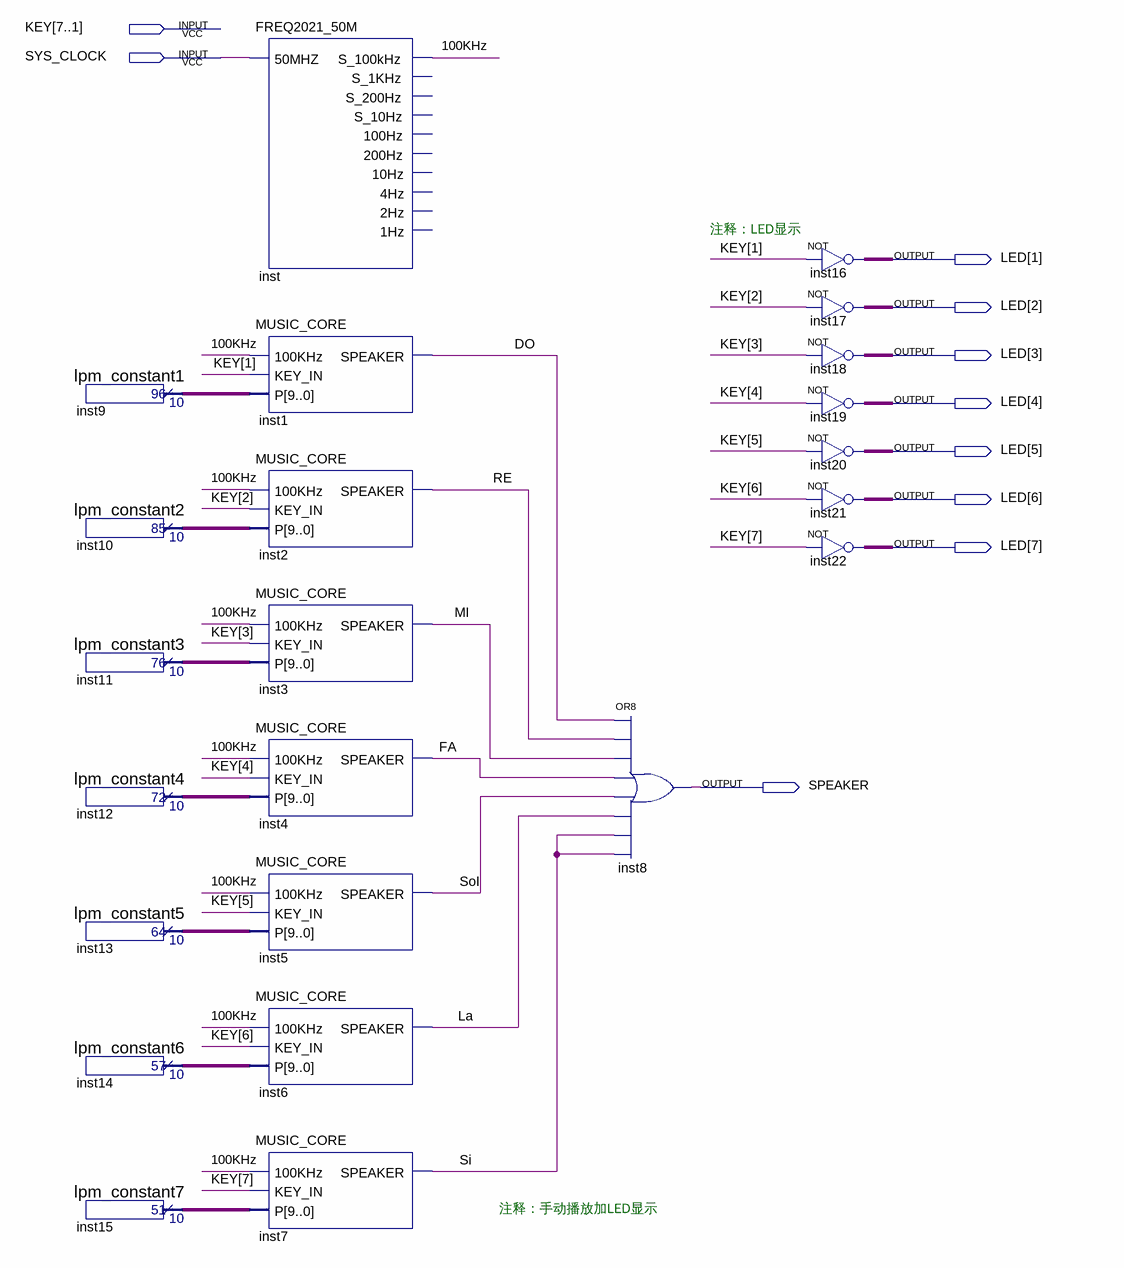
[diagram p0: schematic sheet]
// Quartus schematic PLAY.bdf as structural Verilog: 23 symbols, 10 pins
module PLAY (
  input  [7:1] KEY,
  input  SYS_CLOCK,
  output [7:1] LED,
  output SPEAKER
);

  wire \100KHz , DO, FA, La, MI, RE, Si, SoI;
  wire [9:0] inst9_result, inst10_result, inst11_result, inst12_result, inst13_result, inst14_result,
       inst15_result;

  lpm_constant1 inst9 (.result(inst9_result));
  lpm_constant2 inst10 (.result(inst10_result));
  lpm_constant3 inst11 (.result(inst11_result));
  lpm_constant4 inst12 (.result(inst12_result));
  lpm_constant5 inst13 (.result(inst13_result));
  lpm_constant6 inst14 (.result(inst14_result));
  lpm_constant7 inst15 (.result(inst15_result));
  FREQ2021_50M inst (
    .\50MHZ (SYS_CLOCK), .S_100kHz(\100KHz ));  // open: S_1KHz, S_200Hz, S_10Hz, 100Hz, 200Hz, 10Hz, 4Hz, 2Hz, 1Hz
  MUSIC_CORE inst1 (.\100KHz (\100KHz ), .KEY_IN(KEY[1]), .P(inst9_result), .SPEAKER(DO));
  MUSIC_CORE inst2 (.\100KHz (\100KHz ), .KEY_IN(KEY[2]), .P(inst10_result), .SPEAKER(RE));
  MUSIC_CORE inst3 (.\100KHz (\100KHz ), .KEY_IN(KEY[3]), .P(inst11_result), .SPEAKER(MI));
  MUSIC_CORE inst4 (.\100KHz (\100KHz ), .KEY_IN(KEY[4]), .P(inst12_result), .SPEAKER(FA));
  MUSIC_CORE inst5 (.\100KHz (\100KHz ), .KEY_IN(KEY[5]), .P(inst13_result), .SPEAKER(SoI));
  MUSIC_CORE inst6 (.\100KHz (\100KHz ), .KEY_IN(KEY[6]), .P(inst14_result), .SPEAKER(La));
  MUSIC_CORE inst7 (.\100KHz (\100KHz ), .KEY_IN(KEY[7]), .P(inst15_result), .SPEAKER(Si));
  or inst8 (SPEAKER, DO, RE, MI, FA, SoI, La, Si, Si);
  not inst16 (LED[1], KEY[1]);
  not inst17 (LED[2], KEY[2]);
  not inst18 (LED[3], KEY[3]);
  not inst19 (LED[4], KEY[4]);
  not inst20 (LED[5], KEY[5]);
  not inst21 (LED[6], KEY[6]);
  not inst22 (LED[7], KEY[7]);

  // Notes on the sheet:
  //   注释：LED显示
  //   注释：手动播放加LED显示
endmodule
